# Altium schematic sheet BATT_MGMT.SchDoc
size C; SheetNumber: 3; SheetTotal: 10
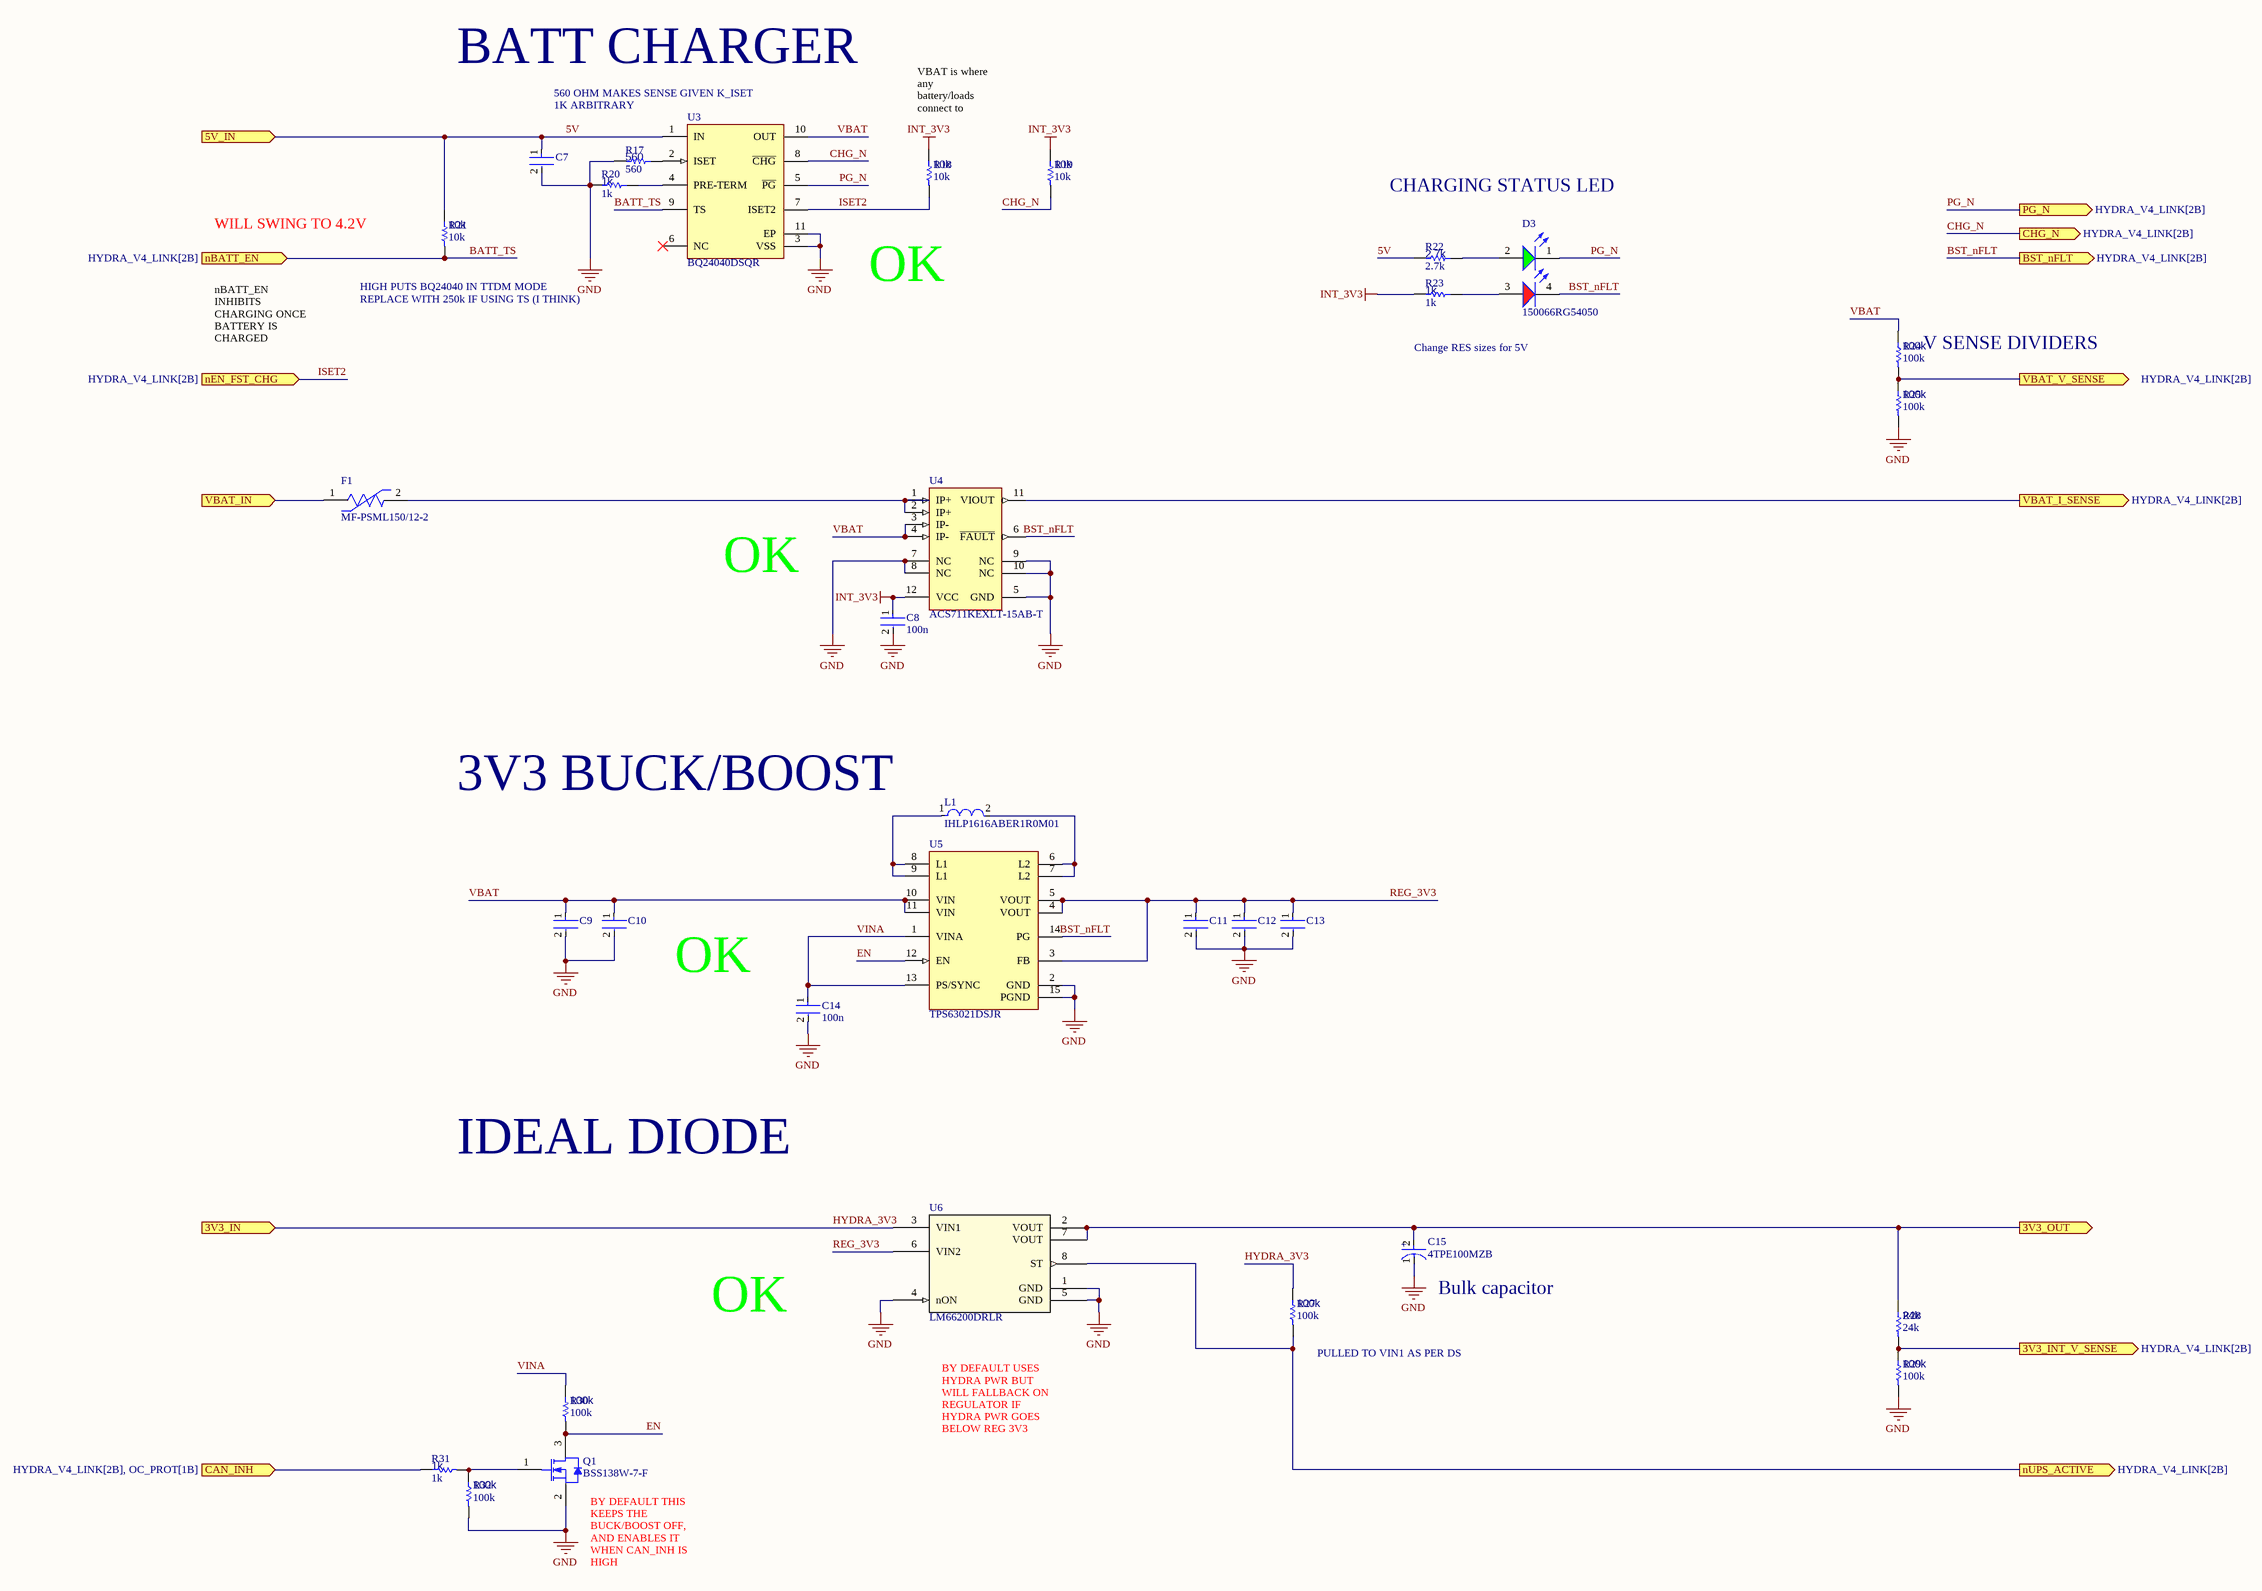
[diagram p0: BATT_MGMT.SchDoc]

## Parts
C7  C0805C106K8PACTU  [FP-C0805C-DG-MFG]  (value not drawn)
C8  100n  [FP-0402-L_1_0_0_05-W_0_5-IPC_A]
C9  C0805C106K8PACTU  [FP-C0805C-DG-MFG]  (value not drawn)
C10  C0805C106K8PACTU  [FP-C0805C-DG-MFG]  (value not drawn)
C11  GRM21BR60J226ME39L  [FP-GRM21B-0_15-MFG]  (value not drawn)
C12  GRM21BR60J226ME39L  [FP-GRM21B-0_15-MFG]  (value not drawn)
C13  GRM21BR60J226ME39L  [FP-GRM21B-0_15-MFG]  (value not drawn)
C14  100n  [FP-0402-L_1_0_0_05-W_0_5-IPC_A]
C15  4TPE100MZB  [FP-POSCAP-B2-MFG]
D3  150066RG54050  [WL-SBCD_0606]
F1  MF-PSML150/12-2  [FP-MF-PSMF-MFG]
L1  IHLP1616ABER1R0M01  [FP-IHLP-1616AB-FP_1_8545x-MFG]
Q1  BSS138W-7-F  [DIOD-SOT323-3_V]
R17  560  [R0603B]
R18  10k  [R0603B]
R19  10k  [R0603B]
R20  1k  [R0603B]
R21  10k  [R0603B]
R22  2.7k  [R0603B]
R23  1k  [R0603B]
R24  100k  [R0603B]
R25  100k  [R0603B]
R27  100k  [R0603B]
R28  24k  [R0603B]
R29  100k  [R0603B]
R30  100k  [R0603B]
R31  1k  [R0603B]
R32  100k  [R0603B]
U3  BQ24040DSQR  [DSQ0010A_V]
U4  ACS711KEXLT-15AB-T  [ALEG-EX-12_V]
U5  TPS63021DSJR  [FP-DSJ0014A-MFG]
U6  LM66200DRLR  [LM66200DRLR-Footprint-1]

## Ports
3V3_IN (in, see HYDRA_V4_LINK[2A]), 3V3_INT_V_SENSE (out, see HYDRA_V4_LINK[2B]), 3V3_OUT (out, see HYDRA_V4_LINK[2A]), 5V_IN (in, see HYDRA_V4_LINK[2A], RFD_PWR_MGMT[1C]), BST_nFLT (out, see HYDRA_V4_LINK[2B]), CAN_INH (in, see HYDRA_V4_LINK[2B], OC_PROT[1B]), CHG_N (out, see HYDRA_V4_LINK[2B]), nBATT_EN (in, see HYDRA_V4_LINK[2B]), nEN_FST_CHG (in, see HYDRA_V4_LINK[2B]), nUPS_ACTIVE (out, see HYDRA_V4_LINK[2B]), PG_N (out, see HYDRA_V4_LINK[2B]), VBAT_I_SENSE (out, see HYDRA_V4_LINK[2B]), VBAT_IN (in, see HYDRA_V4_LINK[2A]), VBAT_V_SENSE (out, see HYDRA_V4_LINK[2B])

## Nets
GND: C7.2 C8.2 C9.2 C10.2 C11.2 C12.2 C13.2 C14.2 C15.1(C) Q1.2(S) R17.2 R20.2 R25.2 R29.2 R32.2 U3.3(VSS) U3.11(EP) U4.5(GND) U4.7(NC) U4.8(NC) U4.9(NC) U4.10(NC) U5.2(GND) U5.15(PGND) U6.1(GND) U6.4(nON) U6.5(GND)
INT_3V3: C8.1 R18.1 R19.1 R23.2 U4.12(VCC)
3V3_INT_V_SENSE: R28.2 R29.1 ; port 3V3_INT_V_SENSE
3V3_OUT: C15.2(A) R28.1 U6.2(VOUT) U6.7(VOUT) ; port 3V3_OUT
5V: C7.1 R21.1 R22.2 U3.1(IN) ; port 5V_IN
BATT_TS: R21.2 U3.9(TS) ; port nBATT_EN
BST_nFLT: D3.4(K) U4.6(~{FAULT}) U5.14(PG) ; port BST_nFLT
CAN_INH: R31.1 ; port CAN_INH
CHG_N: R19.2 U3.8(~{CHG}) ; port CHG_N
EN: Q1.3(D) R30.2 U5.12(EN)
HYDRA_3V3: R27.1 U6.3(VIN1) ; port 3V3_IN
ISET2: R18.2 U3.7(ISET2) ; port nEN_FST_CHG
nUPS_ACTIVE: R27.2 U6.8(ST) ; port nUPS_ACTIVE
PG_N: D3.1(K) U3.5(~{PG}) ; port PG_N
REG_3V3: C11.1 C12.1 C13.1 U5.3(FB) U5.4(VOUT) U5.5(VOUT) U6.6(VIN2)
VBAT: C9.1 C10.1 R24.1 U3.10(OUT) U4.3(IP-) U4.4(IP-) U5.10(VIN) U5.11(VIN)
VBAT_I_SENSE: U4.11(VIOUT) ; port VBAT_I_SENSE
VBAT_IN: F1.1 ; port VBAT_IN
VBAT_V_SENSE: R24.2 R25.1 ; port VBAT_V_SENSE
VINA: C14.1 R30.1 U5.1(VINA) U5.13(PS/SYNC)
NetD3_2: D3.2(A) R22.1
NetD3_3: D3.3(A) R23.1
NetF1_2: F1.2 U4.1(IP+) U4.2(IP+)
NetL1_1: L1.1 U5.8(L1) U5.9(L1)
NetL1_2: L1.2 U5.6(L2) U5.7(L2)
NetQ1_1: Q1.1(G) R31.2 R32.1
NetR17_1: R17.1 U3.2(ISET)
NetR20_1: R20.1 U3.4(PRE-TERM)

Not connected (* = marked no-connect by the designer): U3 6(NC)*

## Notes on the sheet
- BATT CHARGER
- (near U3) 560 OHM MAKES SENSE GIVEN K_ISET
- 1K ARBITRARY
- VBAT is where any battery/loads connect to
- CHARGING STATUS LED
- WILL SWING TO 4.2V
- nBATT_EN INHIBITS CHARGING ONCE BATTERY IS CHARGED
- (near R21) HIGH PUTS BQ24040 IN TTDM MODE
- REPLACE WITH 250k IF USING TS (I THINK)
- OK
- Change RES sizes for 5V
- (near R24) V SENSE DIVIDERS
- 3V3 BUCK/BOOST
- IDEAL DIODE
- (near C15) Bulk capacitor
- (near R27) PULLED TO VIN1 AS PER DS
- BY DEFAULT USES HYDRA PWR BUT WILL FALLBACK ON REGULATOR IF HYDRA PWR GOES BELOW REG 3V3
- (near Q1) BY DEFAULT THIS KEEPS THE BUCK/BOOST OFF, AND ENABLES IT WHEN CAN_INH IS HIGH
- (in symbol CMP-05428-001141-1) +

## Library data of the parts
C7 C9 C10 = CMP-2007-03243-2: CAP CER 10UF 10V X5R 0805; Manufacturer: Kemet; 3DS Part Number: 220-00001; Tolerance: 10%; Temperature Coefficient: 15%; Material: Ceramic; Device Class L2: Capacitors; Device Class L1: Passive Components; ComponentLink2URL: https://content.kemet.com/datasheets/KEM_C1006_X5R_SMD.pdf; Height: 1.4mm; Lead Free: Yes; Manufacturer Part Number: C0805C106K8PACTU; Digikey Description: CAP CER 10UF 10V X5R 0805; Octopart: https://octopart.com/c0805c106k8pactu-kemet-98697; Capacitance: 10uF; Value: C0805C106K8PACTU; Temperature Range Low: -55°C; Temperature: -55°C to +85°C; Automotive: No; Mouser Description: CAP CER 10UF 10V X5R 0805; Ipc Land Pattern Name: CAPC200125X125; Temperature Range High: +85°C; Voltage: 10V; RoHS: TRUE; Device Class L3: Ceramic Capacitors; ComponentLink2Description: Datasheet; Voltage Rating: 10V; Package: C0805C-DG; Temperature Characteristic: X5R; Category: Cap
C8 C14 = CMP-001-00058-1: LARGE PADS, 0402 CAP, CHANGE COMMENT TO MATCH REAL P/N; Capacitor Type: Ceramic; Value: 100n; Min Operating Temperature: -55°C; Mounting Technology: Surface Mount; Pins: 2; Case/Package: 0402; RoHS Compliant: Yes; Max Operating Temperature: 85°C
C11-C13 = CMP-2007-03385-2: Chip Multilayer Ceramic Capacitors for General Purpose, 0805, 22uF, X5R, 15%, 20%, 6.3V; Material: Ceramic; Max Operating Temperature: 85°C; Voltage: 6.3V; Min Operating Temperature: -55°C; Case/Package: 0805; Thickness: 0.053inch; Dielectric: X5R; Packaging: Tape and Reel; Depth: 1.25mm; Termination: SMD/SMT; Voltage Rating (DC): 6.3V; Radiation Hardening: No; Tolerance: 20%; Mount: Surface Mount; Lead Free: Lead Free; Package Quantity: 1; REACH SVHC: No SVHC; Voltage Rating: 6.3V; Capacitance: 22uF; Length: 2mm; Case Code (Imperial): 0805; Case Code (Metric): 2012; Width: 0.049inch; Height: 1.25mm; Value: GRM21BR60J226ME39L
C15 = CMP-05428-001141-1: Molded Tantalum Polymer Capacitor 100uF 20% 4V life 1000Hours SMD 1411; Leakage Current: 40uA; Polarity: Polar; Dissipation Factor: 8%; ESR (Equivalent Series Resistance): 35mR; Ripple Current: 1.4A; Capacitance: 100uF; Voltage: 4V; Voltage Rating (DC): 4V; Package Quantity: 2000; Packaging: Tape and Reel; RoHS Compliant: Yes; Voltage Rating: 4V; Case Code (Imperial): 1210; Construction: Flat; Max Operating Temperature: 105°C; Termination: SMD/SMT; Case Code (Metric): 3528; Case/Package: Molded; Tolerance: 20%; Min Operating Temperature: -55°C; Lead Free: Lead Free; Features: General Purpose; Height: 1.9mm; Length: 3.5mm; Series: POSCAP™ TPE; Number of Pins: 2; Height - Seated (Max): 0.079inch; Mount: Surface Mount; Width: 2.8mm; REACH SVHC: No SVHC; Radiation Hardening: No; Depth: 2.8mm; Value: 4TPE100MZB
D3 = CMP-004-00040-2: Led, Red/Grn, 180Mcd/230Mcd, 624Nm/525Nm Rohs Compliant: Yes; Source: rgled.SchLib; Component Type: Standard; Design Item ID: CMP-004-00034-2; Pins: 4
F1 = CMP-07400-000013-1: Manufacturer Part Number: MF-PSMF050X-2; Manufacturer: Bourns Inc.; Trip Current: 1A; Trip Time: 0.1s; Value: 0.15-0.9Ω; Hold Current: 0.5A; Current Rating: 40A; Voltage Rating: 6V; Category: Fuse; Temperature: -40°C to +85°C; ComponentLink2Description: Datasheet; Temperature Range High: +85°C; Package: MF-PSMF; Device Class L1: Circuit Protection; Lead Free: Yes; ComponentLink2URL: https://www.bourns.com/docs/product-datasheets/mfpsmf.pdf?sfvrsn=9c05cafe_24; Ambient Temperature Range Low: -40°C; Mouser Description: Resettable Fuses - PPTC .50A 6V 0.15ohm Hold .5 Trip 1; Resistance: 0.15-0.9Ω; Automotive: Yes; Ambient Temperature Range High: +85°C; Device Class L2: PTC Resettable Fuses; Temperature Range Low: -40°C; Device Class L3: unset; Octopart: https://octopart.com/mf-psmf050x-2-bourns-7483438; Digikey Description: PTC RESET FUSE 6V 500MA 0805; Height: 0.85mm; RoHS: TRUE
L1 = CMP-02424-000161-1: Fixed Inductors Commercial High Saturation Series SMT 1uH 4A 52.5mΩ 20%; Test Frequency: 100kHz; Max DC Current: 8.5A; Shielding: Shielded; Core Material: Metal; Self Resonant Frequency: 64MHz; Saturation Current: 7A; DC Resistance (DCR): 52.5mR; Radiation Hardening: No; Height - Seated (Max): 0.047inch; Case Code (Imperial): 1616; Case Code (Metric): 4040; Width: 0.16inch; Case/Package: 1616; Depth: 4.31mm; Height: 1.2mm; Inductance Tolerance: 20%; Lead Free: Lead Free; Termination: SMD/SMT; Military Standard: Not; RMS Current (Irms): 4A; Inductance: 1uH; Length: 4.7mm; Package Quantity: 4000; Number of Pins: 1616; Max Operating Temperature: 125°C; Contact Plating: Tin; Tolerance: 20%; Packaging: Tape and Reel; Current Rating: 4A; Min Operating Temperature: -55°C; Mount: Surface Mount
Q1 = CMP-2000-05968-1: N-Channel Enhancement Mode Mosfet, 50 V, 200 mA, -55 to 150 degC, 6-Pin SOT-323, RoHS, Tape and Reel; Typical Turn-Off Delay Time: 20ns; Number of Channels: 1Channel; Type: EnhancementModeFieldEffectTransistor; Brand: DiodesIncorporated; Vds - Drain-Source Breakdown Voltage: 75V; Vgs - Gate-Source Voltage: 20V; Rds On - Drain-Source Resistance: 1.4Ohms; Transistor Type: 1N-Channel; Configuration: Single; Unit Weight: 0.000212oz; Pd - Power Dissipation: 200mW; Id - Continuous Drain Current: 200mA; Forward Transconductance - Min: 0.1S; Manufacturer URL: http://www.diodes.com/; Series: BSS138; Package Description: 3-Pin Small Outline Transistor, Body 2 x 1.25 mm, Pitch 0.65 mm; Mounting Technology: SurfaceMount; Product Category: MOSFET; RoHS: True; Maximum Operating Temperature: +150C; Height: 1mm; Length: 2.2mm; Technology: Si; Width: 1.35mm; Datasheet URL: http://www.diodes.com/_files/datasheets/ds30206.pdf; Manufacturer: DiodesIncorporated; Package / Case: SOT-323-3; Typical Turn-On Delay Time: 20ns; Transistor Polarity: N-Channel; Factory Pack Quantity: 3000; Packaging: Reel; Product: MOSFETSmallSignal; Datasheet Version: Rev. 11-2, 09/2013; Package Reference: SOT323; Minimum Operating Temperature: -55C; Mounting Style: SMD/SMT; Channel Mode: Enhancement
R17-R25 R27-R32 = CMP-009-00002-14: Resistor
  R17: Value: 560
  R18 R19 R21: Value: 10k
  R20 R23 R31: Value: 1k
  R22: Value: 2.7k
  R24 R25 R27 R29 R30 R32: Value: 100k
  R28: Value: 24k
U3 = CMP-0321-00456-2: 800 mA, Single-Input, Single Cell Li-Ion Battery Charger with Auto Start. Vovp=6.6 V, 3.5 V, -40 to 85 degC, 10-pin SON (DSQ), Green (RoHS & no Sb/Br); Manufacturer: Texas Instruments; NiCd: N; Vin(Min)(V): 3.5; SubFamily: Battery Charge Management; PackageDescription: 10-Pin Plastic Small Outline No-Lead, 2 x 2 x 0.8 mm Body, 0.4 mm Pitch, Exposed Pad; PackageVersion: revB, Apr-2010; Mounting Technology: Surface Mount; Eco-Plan: Green (RoHS & no Sb/Br); ComponentLink1URL: http://www.ti.com/general/docs/lit/getliterature.tsp?genericPartNumber=BQ24040&fileType=pdf; PartNumber: BQ24040DSQR; DatasheetVersion: SLUS941A; Over Voltage Protection: N; PackageReference: DSQ0010A; NiMH: N; Li-Ion: N; Lead Acid: N; Li-Polymer: N; ComponentLink1Description: Datasheet
U4 = CMP-1557-00001-1: Hall Effect Linear Current Sensor with Overcurrent Fault Output for <100 V Isolation Applications, 3 to 5.5 V, -15.5 to 15.5 A IP, -40 to 125 degC, 12-Pin QFN (EX), RoHS, Tape and Reel; VCC Max: 5.5 V; IP Max: 15.5 A; VCC Min: 3 V; IP Min: -15.5 A; -3dB Bandwidth: 0.1 MHz; PackageDescription: 12-Pin Quad Flat No-Lead, Body 3 x 3 mm, Height 0.8 mm; ComponentLink1URL: http://www.allegromicro.com/; Packing: Tape and Reel; ComponentLink2URL: http://www.allegromicro.com/~/media/Files/Datasheets/ACS711-Datasheet.ashx?la=en; DatasheetVersion: Rev. 3; PartNumber: ACS711KEXLT-15AB-T; ComponentLink2Description: Datasheet; ComponentLink3URL: http://www.allegromicro.com/~/media/Files/Datasheets/ACS711-Datasheet.ashx?la=en; RoHS: TRUE; ComponentLink1Description: Manufacturer URL; ComponentLink3Description: Package Specification; Temperature Max: 125 degC; Mounting Technology: Surface Mount; Temperature Min: -40 degC
U5 = CMP-019-00052-2: Switching Regulator, Current-mode, 2A, 2600kHz Switching Freq-Max, PDSO14; Max Supply Voltage: 5.5V; Min Operating Temperature: -40°C; Max Operating Temperature: 85°C; Pins: 14; Case/Package: HVSON; RoHS Compliant: Yes
U6 = CMP-019-00049-1: 1.6-V to 5.5-V, 40-mΩ, 2.5-A, low-IQ, dual ideal diode 8-SOT-5X3 -40 to 125